# EAGLE schematic 8bit_computer (EAGLE 9.1.3)
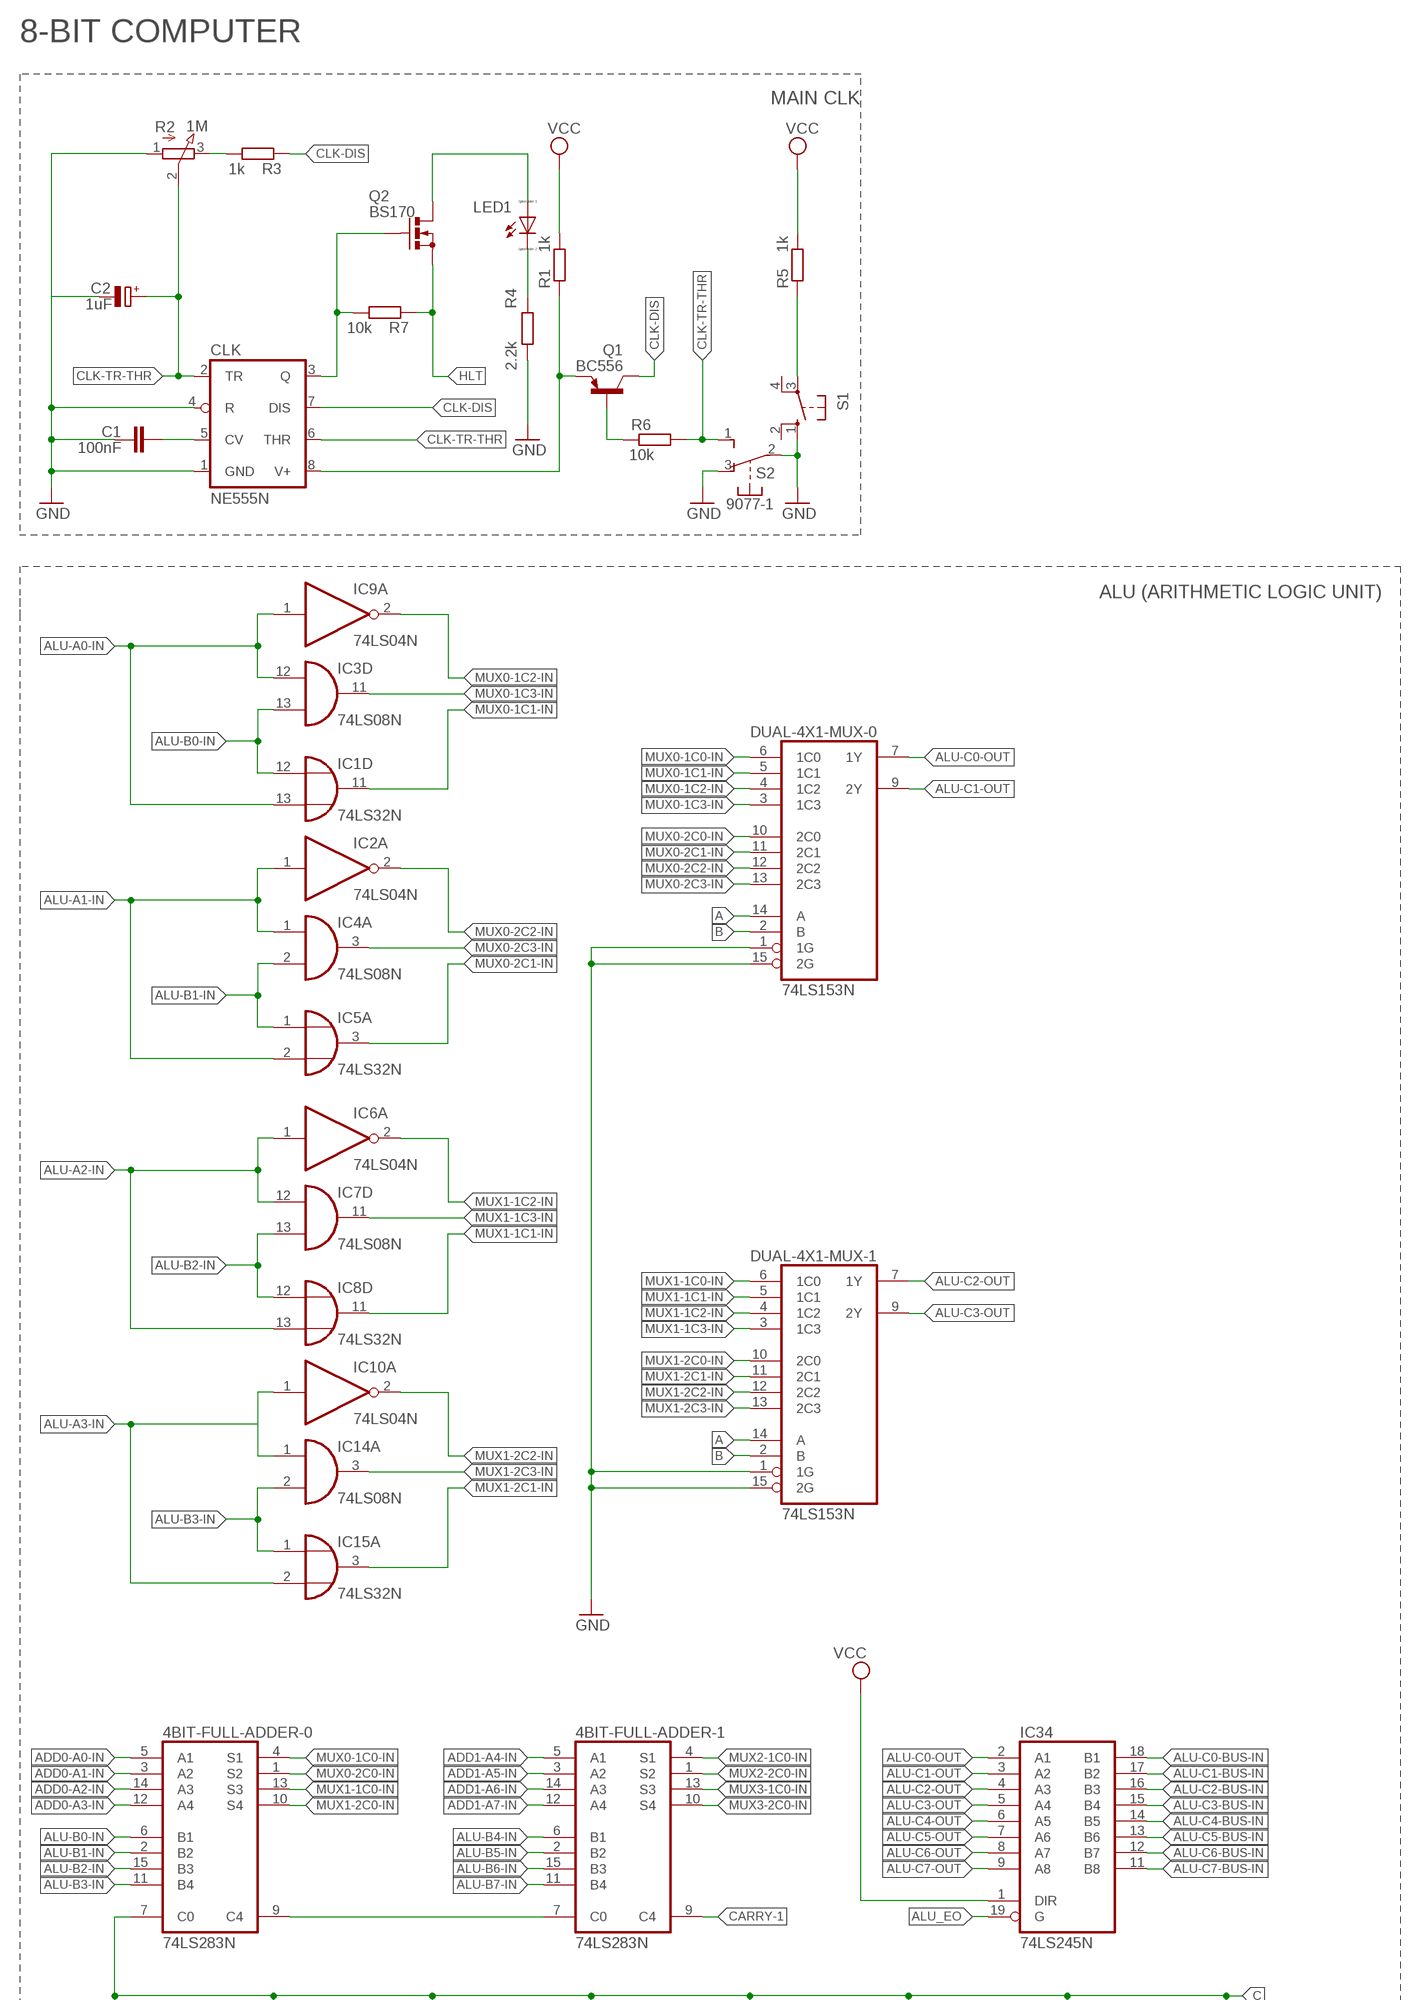
[diagram p0: schematic, sheet 1, part 1 of 3]
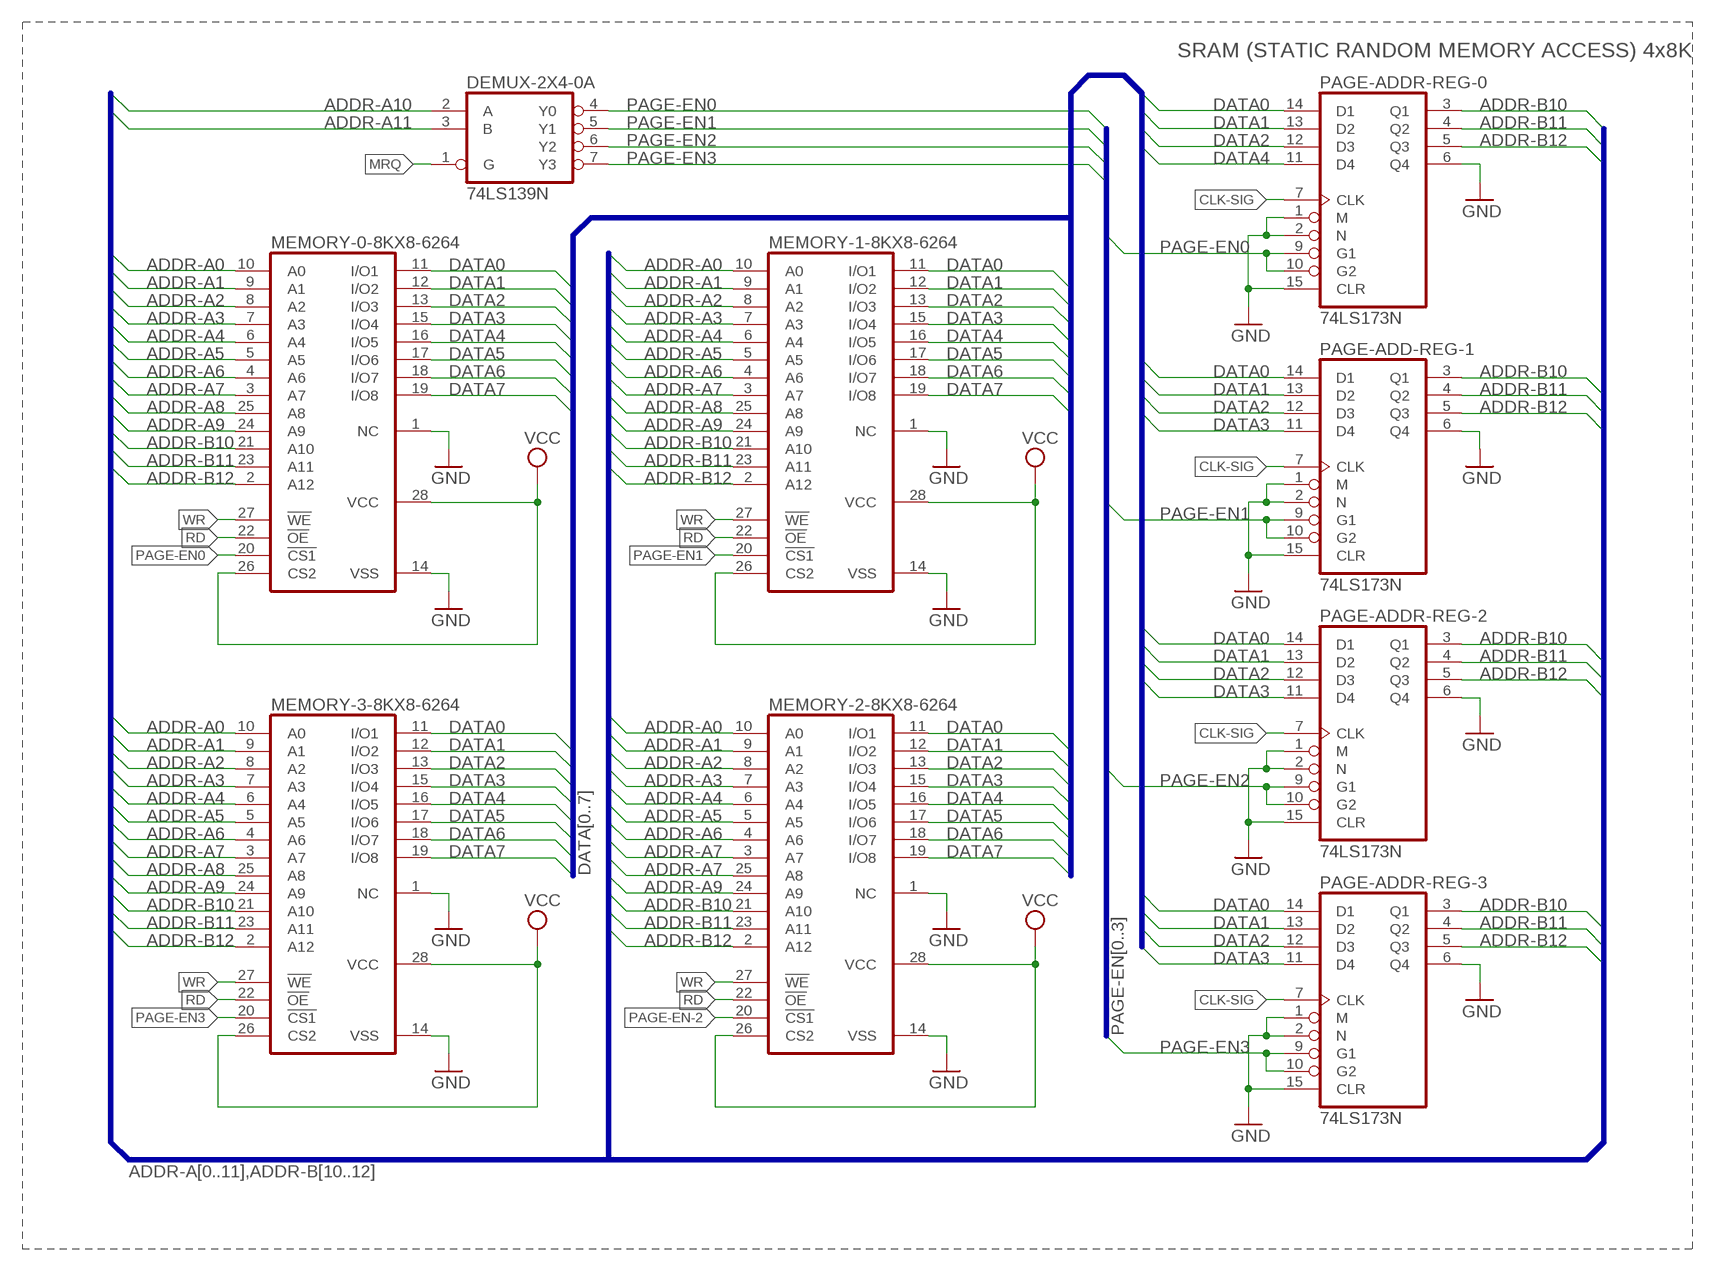
[diagram p1: schematic, sheet 1, part 2 of 3]
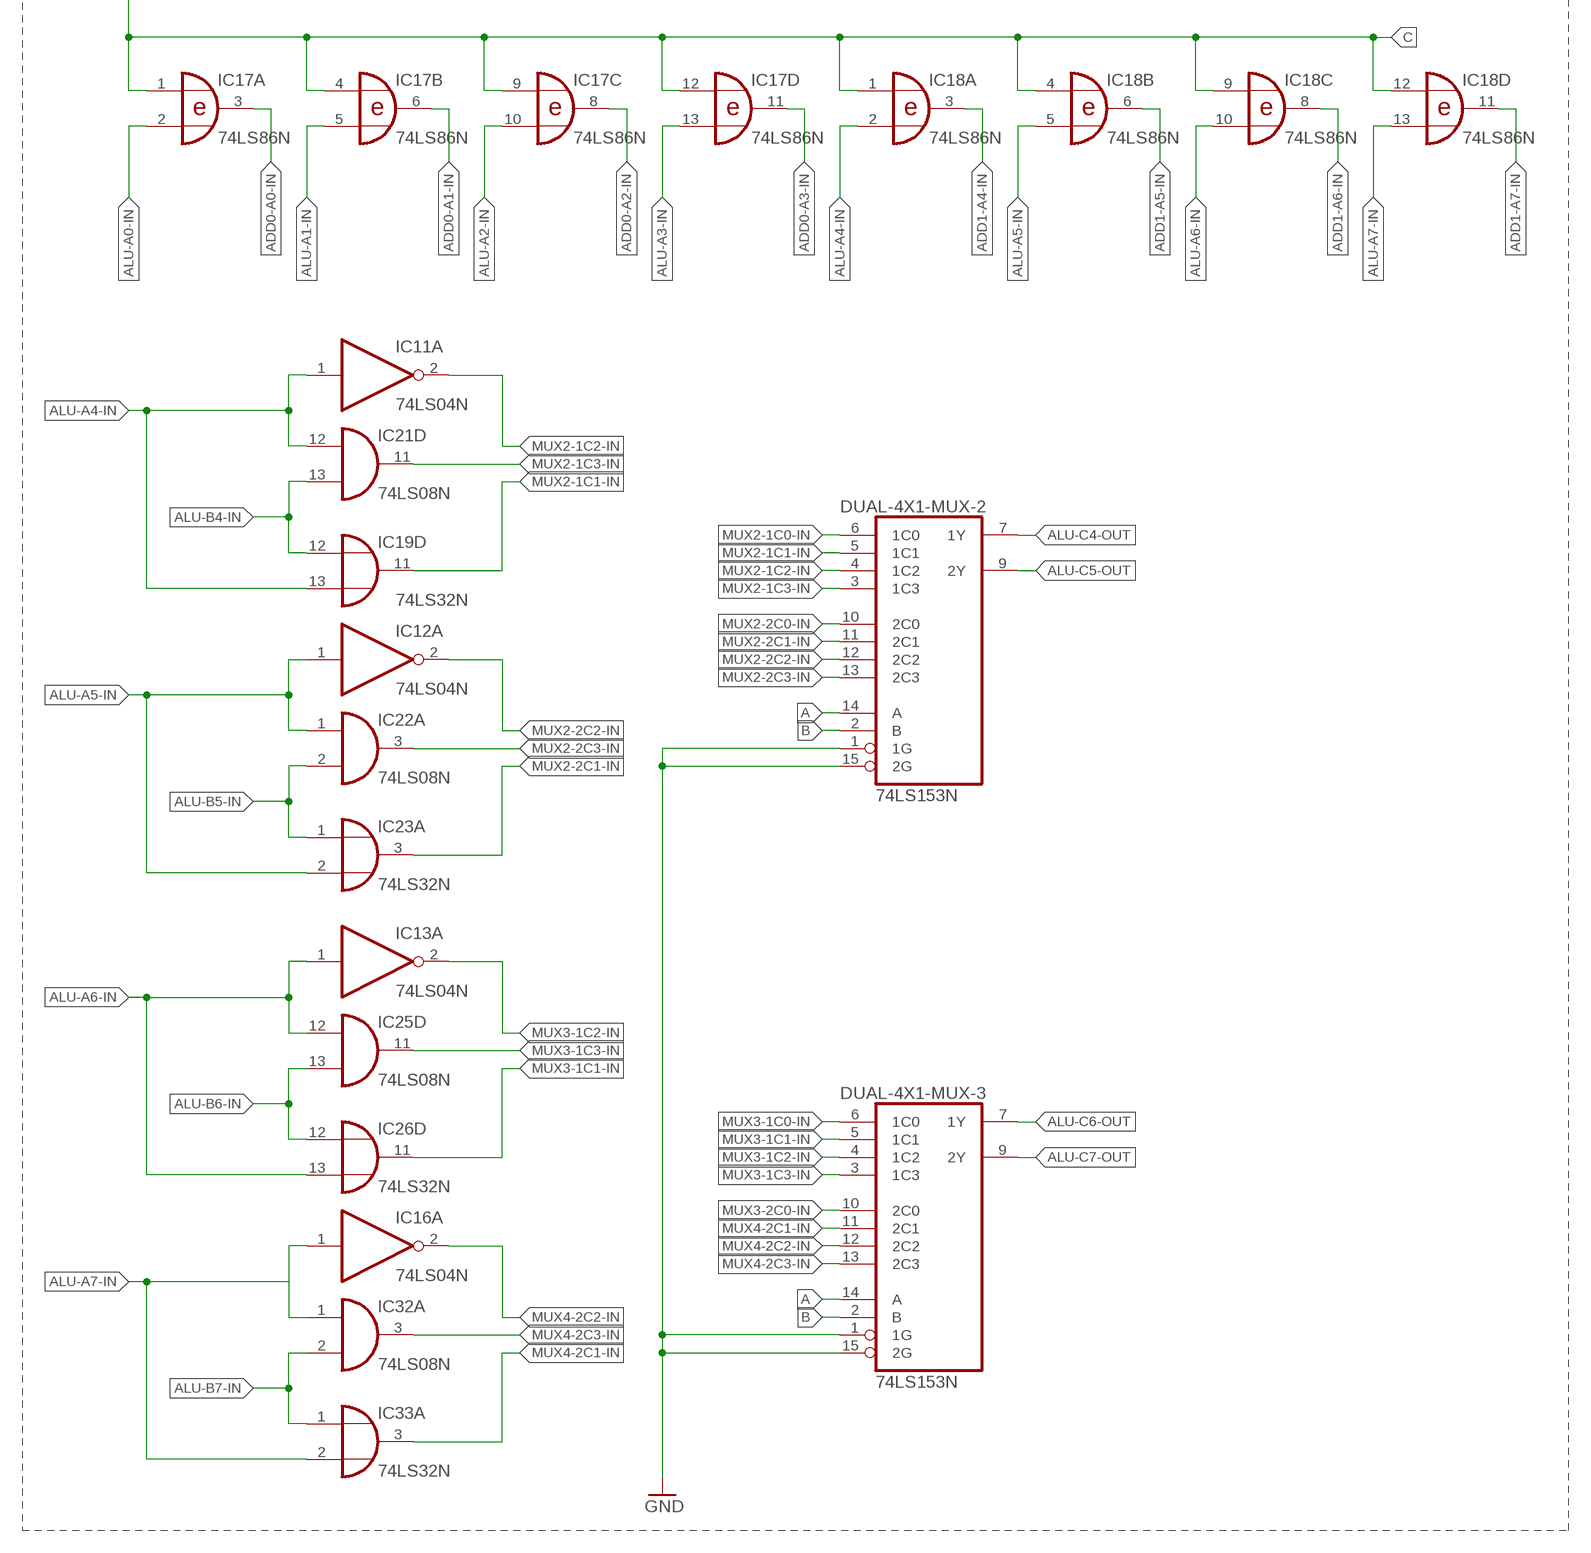
[diagram p2: schematic, sheet 1, part 3 of 3]

## Parts
4BIT-FULL-ADDER-0  74LS283N  [DIL16]
4BIT-FULL-ADDER-1  74LS283N  [DIL16]
C1  100nF  C-EU025-050X050  [C025-050X050]
C2  1uF  CPOL-EUE2-5  [E2-5]
CLK  NE555N  [DIL08]
DEMUX-2X4-0  74LS139N  [DIL16]
DUAL-4X1-MUX-0  74LS153N  [DIL16]
DUAL-4X1-MUX-1  74LS153N  [DIL16]
DUAL-4X1-MUX-2  74LS153N  [DIL16]
DUAL-4X1-MUX-3  74LS153N  [DIL16]
IC1  74LS32N  [DIL14]
IC2  74LS04N  [DIL14]
IC3  74LS08N  [DIL14]
IC4  74LS08N  [DIL14]
IC5  74LS32N  [DIL14]
IC6  74LS04N  [DIL14]
IC7  74LS08N  [DIL14]
IC8  74LS32N  [DIL14]
IC9  74LS04N  [DIL14]
IC10  74LS04N  [DIL14]
IC11  74LS04N  [DIL14]
IC12  74LS04N  [DIL14]
IC13  74LS04N  [DIL14]
IC14  74LS08N  [DIL14]
IC15  74LS32N  [DIL14]
IC16  74LS04N  [DIL14]
IC17  74LS86N  [DIL14]
IC18  74LS86N  [DIL14]
IC19  74LS32N  [DIL14]
IC21  74LS08N  [DIL14]
IC22  74LS08N  [DIL14]
IC23  74LS32N  [DIL14]
IC25  74LS08N  [DIL14]
IC26  74LS32N  [DIL14]
IC32  74LS08N  [DIL14]
IC33  74LS32N  [DIL14]
IC34  74LS245N  [DIL20]
LED1  LED_ELD260  [LED_LD260]
MEMORY-0-8KX8-6264  6264A  [DIL28-6]
MEMORY-1-8KX8-6264  6264A  [DIL28-6]
MEMORY-2-8KX8-6264  6264A  [DIL28-6]
MEMORY-3-8KX8-6264  6264A  [DIL28-6]
PAGE-ADD-REG-1  74LS173N  [DIL16]
PAGE-ADDR-REG-0  74LS173N  [DIL16]
PAGE-ADDR-REG-2  74LS173N  [DIL16]
PAGE-ADDR-REG-3  74LS173N  [DIL16]
Q1  BC556  [TO92-EBC]
Q2  BS170  [SOT54E]
R1  1k  R-EU_0204/5  [0204/5]
R2  1M  3RP/1610N  [3RP/1610N]
R3  1k  R-EU_0204/5  [0204/5]
R4  2.2k  R-EU_0204/5  [0204/5]
R5  1k  R-EU_0204/5  [0204/5]
R6  10k  R-EU_0204/5  [0204/5]
R7  10k  R-EU_0204/5  [0204/5]
S1  10-XX  [B3F-10XX]
S2  9077-1  [9077-1]

## Nets
A: DUAL-4X1-MUX-0.14(A) DUAL-4X1-MUX-1.14(A) DUAL-4X1-MUX-2.14(A) DUAL-4X1-MUX-3.14(A)
ADD0-A0-IN: 4BIT-FULL-ADDER-0.5(A1) IC17.3(A:O)
ADD0-A1-IN: 4BIT-FULL-ADDER-0.3(A2) IC17.6(B:O)
ADD0-A2-IN: 4BIT-FULL-ADDER-0.14(A3) IC17.8(C:O)
ADD0-A3-IN: 4BIT-FULL-ADDER-0.12(A4) IC17.11(D:O)
ADD1-A4-IN: 4BIT-FULL-ADDER-1.5(A1) IC18.3(A:O)
ADD1-A5-IN: 4BIT-FULL-ADDER-1.3(A2) IC18.6(B:O)
ADD1-A6-IN: 4BIT-FULL-ADDER-1.14(A3) IC18.8(C:O)
ADD1-A7-IN: 4BIT-FULL-ADDER-1.12(A4) IC18.11(D:O)
ADDR-A0: MEMORY-0-8KX8-6264.10(A0) MEMORY-1-8KX8-6264.10(A0) MEMORY-2-8KX8-6264.10(A0) MEMORY-3-8KX8-6264.10(A0)
ADDR-A1: MEMORY-0-8KX8-6264.9(A1) MEMORY-1-8KX8-6264.9(A1) MEMORY-2-8KX8-6264.9(A1) MEMORY-3-8KX8-6264.9(A1)
ADDR-A2: MEMORY-0-8KX8-6264.8(A2) MEMORY-1-8KX8-6264.8(A2) MEMORY-2-8KX8-6264.8(A2) MEMORY-3-8KX8-6264.8(A2)
ADDR-A3: MEMORY-0-8KX8-6264.7(A3) MEMORY-1-8KX8-6264.7(A3) MEMORY-2-8KX8-6264.7(A3) MEMORY-3-8KX8-6264.7(A3)
ADDR-A4: MEMORY-0-8KX8-6264.6(A4) MEMORY-1-8KX8-6264.6(A4) MEMORY-2-8KX8-6264.6(A4) MEMORY-3-8KX8-6264.6(A4)
ADDR-A5: MEMORY-0-8KX8-6264.5(A5) MEMORY-1-8KX8-6264.5(A5) MEMORY-2-8KX8-6264.5(A5) MEMORY-3-8KX8-6264.5(A5)
ADDR-A6: MEMORY-0-8KX8-6264.4(A6) MEMORY-1-8KX8-6264.4(A6) MEMORY-2-8KX8-6264.4(A6) MEMORY-3-8KX8-6264.4(A6)
ADDR-A7: MEMORY-0-8KX8-6264.3(A7) MEMORY-1-8KX8-6264.3(A7) MEMORY-2-8KX8-6264.3(A7) MEMORY-2-8KX8-6264.25(A8) MEMORY-3-8KX8-6264.3(A7)
ADDR-A8: MEMORY-0-8KX8-6264.25(A8) MEMORY-1-8KX8-6264.25(A8) MEMORY-3-8KX8-6264.25(A8)
ADDR-A9: MEMORY-0-8KX8-6264.24(A9) MEMORY-1-8KX8-6264.24(A9) MEMORY-2-8KX8-6264.24(A9) MEMORY-3-8KX8-6264.24(A9)
ADDR-A10: DEMUX-2X4-0.2(A:A)
ADDR-A11: DEMUX-2X4-0.3(A:B)
ADDR-B10: MEMORY-0-8KX8-6264.21(A10) MEMORY-1-8KX8-6264.21(A10) MEMORY-2-8KX8-6264.21(A10) MEMORY-3-8KX8-6264.21(A10) PAGE-ADD-REG-1.3(Q1) PAGE-ADDR-REG-0.3(Q1) PAGE-ADDR-REG-2.3(Q1) PAGE-ADDR-REG-3.3(Q1)
ADDR-B11: MEMORY-0-8KX8-6264.23(A11) MEMORY-1-8KX8-6264.23(A11) MEMORY-2-8KX8-6264.23(A11) MEMORY-3-8KX8-6264.23(A11) PAGE-ADD-REG-1.4(Q2) PAGE-ADDR-REG-0.4(Q2) PAGE-ADDR-REG-2.4(Q2) PAGE-ADDR-REG-3.4(Q2)
ADDR-B12: MEMORY-0-8KX8-6264.2(A12) MEMORY-1-8KX8-6264.2(A12) MEMORY-2-8KX8-6264.2(A12) MEMORY-3-8KX8-6264.2(A12) PAGE-ADD-REG-1.5(Q3) PAGE-ADDR-REG-0.5(Q3) PAGE-ADDR-REG-2.5(Q3) PAGE-ADDR-REG-3.5(Q3)
ALU-A0-IN: IC1.13(D:I1) IC3.12(D:I0) IC9.1(A:I) IC17.2(A:I1)
ALU-A1-IN: IC2.1(A:I) IC4.1(A:I0) IC5.2(A:I1) IC17.5(B:I1)
ALU-A2-IN: IC6.1(A:I) IC7.12(D:I0) IC8.13(D:I1) IC17.10(C:I1)
ALU-A3-IN: IC10.1(A:I) IC14.1(A:I0) IC15.2(A:I1) IC17.13(D:I1)
ALU-A4-IN: IC11.1(A:I) IC18.2(A:I1) IC19.13(D:I1) IC21.12(D:I0)
ALU-A5-IN: IC12.1(A:I) IC18.5(B:I1) IC22.1(A:I0) IC23.2(A:I1)
ALU-A6-IN: IC13.1(A:I) IC18.10(C:I1) IC25.12(D:I0) IC26.13(D:I1)
ALU-A7-IN: IC16.1(A:I) IC18.13(D:I1) IC32.1(A:I0) IC33.2(A:I1)
ALU-B0-IN: 4BIT-FULL-ADDER-0.6(B1) IC1.12(D:I0) IC3.13(D:I1)
ALU-B1-IN: 4BIT-FULL-ADDER-0.2(B2) IC4.2(A:I1) IC5.1(A:I0)
ALU-B2-IN: 4BIT-FULL-ADDER-0.15(B3) IC7.13(D:I1) IC8.12(D:I0)
ALU-B3-IN: 4BIT-FULL-ADDER-0.11(B4) IC14.2(A:I1) IC15.1(A:I0)
ALU-B4-IN: 4BIT-FULL-ADDER-1.6(B1) IC19.12(D:I0) IC21.13(D:I1)
ALU-B5-IN: 4BIT-FULL-ADDER-1.2(B2) IC22.2(A:I1) IC23.1(A:I0)
ALU-B6-IN: 4BIT-FULL-ADDER-1.15(B3) IC25.13(D:I1) IC26.12(D:I0)
ALU-B7-IN: 4BIT-FULL-ADDER-1.11(B4) IC32.2(A:I1) IC33.1(A:I0)
ALU-C0-BUS-IN: IC34.18(B1)
ALU-C0-OUT: DUAL-4X1-MUX-0.7(1Y) IC34.2(A1)
ALU-C1-BUS-IN: IC34.17(B2)
ALU-C1-OUT: DUAL-4X1-MUX-0.9(2Y) IC34.3(A2)
ALU-C2-BUS-IN: IC34.16(B3)
ALU-C2-OUT: DUAL-4X1-MUX-1.7(1Y) IC34.4(A3)
ALU-C3-BUS-IN: IC34.15(B4)
ALU-C3-OUT: DUAL-4X1-MUX-1.9(2Y) IC34.5(A4)
ALU-C4-BUS-IN: IC34.14(B5)
ALU-C4-OUT: DUAL-4X1-MUX-2.7(1Y) IC34.6(A5)
ALU-C5-BUS-IN: IC34.13(B6)
ALU-C5-OUT: DUAL-4X1-MUX-2.9(2Y) IC34.7(A6)
ALU-C6-BUS-IN: IC34.12(B7)
ALU-C6-OUT: DUAL-4X1-MUX-3.7(1Y) IC34.8(A7)
ALU-C7-BUS-IN: IC34.11(B8)
ALU-C7-OUT: DUAL-4X1-MUX-3.9(2Y) IC34.9(A8)
ALU_EO: IC34.19(G)
B: DUAL-4X1-MUX-0.2(B) DUAL-4X1-MUX-1.2(B) DUAL-4X1-MUX-2.2(B) DUAL-4X1-MUX-3.2(B)
C: 4BIT-FULL-ADDER-0.7(C0) IC17.1(A:I0) IC17.4(B:I0) IC17.9(C:I0) IC17.12(D:I0) IC18.1(A:I0) IC18.4(B:I0) IC18.9(C:I0) IC18.12(D:I0)
CARRY-1: 4BIT-FULL-ADDER-1.9(C4)
CLK-CV: C1.2 CLK.5(CV)
CLK-DIS: CLK.7(DIS) Q1.C R3.1
CLK-SIG: PAGE-ADD-REG-1.7(CLK) PAGE-ADDR-REG-0.7(CLK) PAGE-ADDR-REG-2.7(CLK) PAGE-ADDR-REG-3.7(CLK)
CLK-TR-THR: C2.+ CLK.2(TR) CLK.6(THR) Q1.B R2.2(S) R6.1 R6.2 S2.1(S)
DATA0: MEMORY-0-8KX8-6264.11(I/O1) MEMORY-1-8KX8-6264.11(I/O1) MEMORY-2-8KX8-6264.11(I/O1) MEMORY-3-8KX8-6264.11(I/O1) PAGE-ADD-REG-1.14(D1) PAGE-ADDR-REG-0.14(D1) PAGE-ADDR-REG-2.14(D1) PAGE-ADDR-REG-3.14(D1)
DATA1: MEMORY-0-8KX8-6264.12(I/O2) MEMORY-1-8KX8-6264.12(I/O2) MEMORY-2-8KX8-6264.12(I/O2) MEMORY-3-8KX8-6264.12(I/O2) PAGE-ADD-REG-1.13(D2) PAGE-ADDR-REG-0.13(D2) PAGE-ADDR-REG-2.13(D2) PAGE-ADDR-REG-3.13(D2)
DATA2: MEMORY-0-8KX8-6264.13(I/O3) MEMORY-1-8KX8-6264.13(I/O3) MEMORY-2-8KX8-6264.13(I/O3) MEMORY-3-8KX8-6264.13(I/O3) PAGE-ADD-REG-1.12(D3) PAGE-ADDR-REG-0.12(D3) PAGE-ADDR-REG-2.12(D3) PAGE-ADDR-REG-3.12(D3)
DATA3: MEMORY-0-8KX8-6264.15(I/O4) MEMORY-1-8KX8-6264.15(I/O4) MEMORY-2-8KX8-6264.15(I/O4) MEMORY-3-8KX8-6264.15(I/O4) PAGE-ADD-REG-1.11(D4) PAGE-ADDR-REG-2.11(D4) PAGE-ADDR-REG-3.11(D4)
DATA4: MEMORY-0-8KX8-6264.16(I/O5) MEMORY-1-8KX8-6264.16(I/O5) MEMORY-2-8KX8-6264.16(I/O5) MEMORY-3-8KX8-6264.16(I/O5) PAGE-ADDR-REG-0.11(D4)
DATA5: MEMORY-0-8KX8-6264.17(I/O6) MEMORY-1-8KX8-6264.17(I/O6) MEMORY-2-8KX8-6264.17(I/O6) MEMORY-3-8KX8-6264.17(I/O6)
DATA6: MEMORY-0-8KX8-6264.18(I/O7) MEMORY-1-8KX8-6264.18(I/O7) MEMORY-2-8KX8-6264.18(I/O7) MEMORY-3-8KX8-6264.18(I/O7)
DATA7: MEMORY-0-8KX8-6264.19(I/O8) MEMORY-1-8KX8-6264.19(I/O8) MEMORY-2-8KX8-6264.19(I/O8) MEMORY-3-8KX8-6264.19(I/O8)
GND: C1.1 C2.- CLK.1(GND) CLK.4(R) DUAL-4X1-MUX-0.1(1G) DUAL-4X1-MUX-0.15(2G) DUAL-4X1-MUX-1.1(1G) DUAL-4X1-MUX-1.15(2G) DUAL-4X1-MUX-2.1(1G) DUAL-4X1-MUX-2.15(2G) DUAL-4X1-MUX-3.1(1G) DUAL-4X1-MUX-3.15(2G) MEMORY-0-8KX8-6264.1(NC) MEMORY-0-8KX8-6264.14(VSS) MEMORY-1-8KX8-6264.1(NC) MEMORY-1-8KX8-6264.14(VSS) MEMORY-2-8KX8-6264.1(NC) MEMORY-2-8KX8-6264.14(VSS) MEMORY-3-8KX8-6264.1(NC) MEMORY-3-8KX8-6264.14(VSS) PAGE-ADD-REG-1.1(M) PAGE-ADD-REG-1.2(N) PAGE-ADD-REG-1.6(Q4) PAGE-ADD-REG-1.15(CLR) PAGE-ADDR-REG-0.1(M) PAGE-ADDR-REG-0.2(N) PAGE-ADDR-REG-0.6(Q4) PAGE-ADDR-REG-0.15(CLR) PAGE-ADDR-REG-2.1(M) PAGE-ADDR-REG-2.2(N) PAGE-ADDR-REG-2.6(Q4) PAGE-ADDR-REG-2.15(CLR) PAGE-ADDR-REG-3.1(M) PAGE-ADDR-REG-3.2(N) PAGE-ADDR-REG-3.6(Q4) PAGE-ADDR-REG-3.15(CLR) R2.1(A) R4.2 S1.1(S) S2.2(P) S2.3(O)
HLT: Q2.S R7.1
MRQ: DEMUX-2X4-0.1(A:G)
MUX0-1C0-IN: 4BIT-FULL-ADDER-0.4(S1) DUAL-4X1-MUX-0.6(1C0)
MUX0-1C1-IN: DUAL-4X1-MUX-0.5(1C1) IC1.11(D:O)
MUX0-1C2-IN: DUAL-4X1-MUX-0.4(1C2) IC9.2(A:O)
MUX0-1C3-IN: DUAL-4X1-MUX-0.3(1C3) IC3.11(D:O)
MUX0-2C0-IN: 4BIT-FULL-ADDER-0.1(S2) DUAL-4X1-MUX-0.10(2C0)
MUX0-2C1-IN: DUAL-4X1-MUX-0.11(2C1) IC5.3(A:O)
MUX0-2C2-IN: DUAL-4X1-MUX-0.12(2C2) IC2.2(A:O)
MUX0-2C3-IN: DUAL-4X1-MUX-0.13(2C3) IC4.3(A:O)
MUX1-1C0-IN: 4BIT-FULL-ADDER-0.13(S3) DUAL-4X1-MUX-1.6(1C0)
MUX1-1C1-IN: DUAL-4X1-MUX-1.5(1C1) IC8.11(D:O)
MUX1-1C2-IN: DUAL-4X1-MUX-1.4(1C2) IC6.2(A:O)
MUX1-1C3-IN: DUAL-4X1-MUX-1.3(1C3) IC7.11(D:O)
MUX1-2C0-IN: 4BIT-FULL-ADDER-0.10(S4) DUAL-4X1-MUX-1.10(2C0)
MUX1-2C1-IN: DUAL-4X1-MUX-1.11(2C1) IC15.3(A:O)
MUX1-2C2-IN: DUAL-4X1-MUX-1.12(2C2) IC10.2(A:O)
MUX1-2C3-IN: DUAL-4X1-MUX-1.13(2C3) IC14.3(A:O)
MUX2-1C0-IN: 4BIT-FULL-ADDER-1.4(S1) DUAL-4X1-MUX-2.6(1C0)
MUX2-1C1-IN: DUAL-4X1-MUX-2.5(1C1) IC19.11(D:O)
MUX2-1C2-IN: DUAL-4X1-MUX-2.4(1C2) IC11.2(A:O)
MUX2-1C3-IN: DUAL-4X1-MUX-2.3(1C3) IC21.11(D:O)
MUX2-2C0-IN: 4BIT-FULL-ADDER-1.1(S2) DUAL-4X1-MUX-2.10(2C0)
MUX2-2C1-IN: DUAL-4X1-MUX-2.11(2C1) IC23.3(A:O)
MUX2-2C2-IN: DUAL-4X1-MUX-2.12(2C2) IC12.2(A:O)
MUX2-2C3-IN: DUAL-4X1-MUX-2.13(2C3) IC22.3(A:O)
MUX3-1C0-IN: 4BIT-FULL-ADDER-1.13(S3) DUAL-4X1-MUX-3.6(1C0)
MUX3-1C1-IN: DUAL-4X1-MUX-3.5(1C1) IC26.11(D:O)
MUX3-1C2-IN: DUAL-4X1-MUX-3.4(1C2) IC13.2(A:O)
MUX3-1C3-IN: DUAL-4X1-MUX-3.3(1C3) IC25.11(D:O)
MUX3-2C0-IN: 4BIT-FULL-ADDER-1.10(S4) DUAL-4X1-MUX-3.10(2C0)
MUX4-2C1-IN: DUAL-4X1-MUX-3.11(2C1) IC33.3(A:O)
MUX4-2C2-IN: DUAL-4X1-MUX-3.12(2C2) IC16.2(A:O)
MUX4-2C3-IN: DUAL-4X1-MUX-3.13(2C3) IC32.3(A:O)
N$1: R5.1 S1.3(P)
N$2: R2.3(E) R3.2
N$3: CLK.8(V+) Q1.E R1.1
N$4: LED1.K(C) R4.1
N$5: 4BIT-FULL-ADDER-0.9(C4) 4BIT-FULL-ADDER-1.7(C0)
N$6: LED1.A Q2.D
PAGE-EN0: DEMUX-2X4-0.4(A:Y0) MEMORY-0-8KX8-6264.20(!CS1) PAGE-ADDR-REG-0.9(G1) PAGE-ADDR-REG-0.10(G2)
PAGE-EN1: DEMUX-2X4-0.5(A:Y1) MEMORY-1-8KX8-6264.20(!CS1) PAGE-ADD-REG-1.9(G1) PAGE-ADD-REG-1.10(G2)
PAGE-EN2: DEMUX-2X4-0.6(A:Y2) PAGE-ADDR-REG-2.9(G1) PAGE-ADDR-REG-2.10(G2)
PAGE-EN3: DEMUX-2X4-0.7(A:Y3) MEMORY-3-8KX8-6264.20(!CS1) PAGE-ADDR-REG-3.9(G1) PAGE-ADDR-REG-3.10(G2)
PAGE-EN-2: MEMORY-2-8KX8-6264.20(!CS1)
Q: CLK.3(Q) Q2.G R7.2
RD: MEMORY-0-8KX8-6264.22(!OE) MEMORY-1-8KX8-6264.22(!OE) MEMORY-2-8KX8-6264.22(!OE) MEMORY-3-8KX8-6264.22(!OE)
VCC: IC34.1(DIR) MEMORY-0-8KX8-6264.26(CS2) MEMORY-0-8KX8-6264.28(VCC) MEMORY-1-8KX8-6264.26(CS2) MEMORY-1-8KX8-6264.28(VCC) MEMORY-2-8KX8-6264.26(CS2) MEMORY-2-8KX8-6264.28(VCC) MEMORY-3-8KX8-6264.26(CS2) MEMORY-3-8KX8-6264.28(VCC) R1.2 R5.2
WR: MEMORY-0-8KX8-6264.27(!WE) MEMORY-1-8KX8-6264.27(!WE) MEMORY-2-8KX8-6264.27(!WE) MEMORY-3-8KX8-6264.27(!WE)
Unconnected: DEMUX-2X4-0.9(B:Y3) DEMUX-2X4-0.10(B:Y2) DEMUX-2X4-0.11(B:Y1) DEMUX-2X4-0.12(B:Y0) DEMUX-2X4-0.13(B:B) DEMUX-2X4-0.14(B:A) DEMUX-2X4-0.15(B:G) IC1.1(A:I0) IC1.2(A:I1) IC1.3(A:O) IC1.4(B:I0) IC1.5(B:I1) IC1.6(B:O) IC1.8(C:O) IC1.9(C:I0) IC1.10(C:I1) IC2.3(B:I) IC2.4(B:O) IC2.5(C:I) IC2.6(C:O) IC2.8(D:O) IC2.9(D:I) IC2.10(E:O) IC2.11(E:I) IC2.12(F:O) IC2.13(F:I) IC3.1(A:I0) IC3.2(A:I1) IC3.3(A:O) IC3.4(B:I0) IC3.5(B:I1) IC3.6(B:O) IC3.8(C:O) IC3.9(C:I0) IC3.10(C:I1) IC4.4(B:I0) IC4.5(B:I1) IC4.6(B:O) IC4.8(C:O) IC4.9(C:I0) IC4.10(C:I1) IC4.11(D:O) IC4.12(D:I0) IC4.13(D:I1) IC5.4(B:I0) IC5.5(B:I1) IC5.6(B:O) IC5.8(C:O) IC5.9(C:I0) IC5.10(C:I1) IC5.11(D:O) IC5.12(D:I0) IC5.13(D:I1) IC6.3(B:I) IC6.4(B:O) IC6.5(C:I) IC6.6(C:O) IC6.8(D:O) IC6.9(D:I) IC6.10(E:O) IC6.11(E:I) IC6.12(F:O) IC6.13(F:I) IC7.1(A:I0) IC7.2(A:I1) IC7.3(A:O) IC7.4(B:I0) IC7.5(B:I1) IC7.6(B:O) IC7.8(C:O) IC7.9(C:I0) IC7.10(C:I1) IC8.1(A:I0) IC8.2(A:I1) IC8.3(A:O) IC8.4(B:I0) IC8.5(B:I1) IC8.6(B:O) IC8.8(C:O) IC8.9(C:I0) IC8.10(C:I1) IC9.3(B:I) IC9.4(B:O) IC9.5(C:I) IC9.6(C:O) IC9.8(D:O) IC9.9(D:I) IC9.10(E:O) IC9.11(E:I) IC9.12(F:O) IC9.13(F:I) IC10.3(B:I) IC10.4(B:O) IC10.5(C:I) IC10.6(C:O) IC10.8(D:O) IC10.9(D:I) IC10.10(E:O) IC10.11(E:I) IC10.12(F:O) IC10.13(F:I) IC11.3(B:I) IC11.4(B:O) IC11.5(C:I) IC11.6(C:O) IC11.8(D:O) IC11.9(D:I) IC11.10(E:O) IC11.11(E:I) IC11.12(F:O) IC11.13(F:I) IC12.3(B:I) IC12.4(B:O) IC12.5(C:I) IC12.6(C:O) IC12.8(D:O) IC12.9(D:I) IC12.10(E:O) IC12.11(E:I) IC12.12(F:O) IC12.13(F:I) IC13.3(B:I) IC13.4(B:O) IC13.5(C:I) IC13.6(C:O) IC13.8(D:O) IC13.9(D:I) IC13.10(E:O) IC13.11(E:I) IC13.12(F:O) IC13.13(F:I) IC14.4(B:I0) IC14.5(B:I1) IC14.6(B:O) IC14.8(C:O) IC14.9(C:I0) IC14.10(C:I1) IC14.11(D:O) IC14.12(D:I0) IC14.13(D:I1) IC15.4(B:I0) IC15.5(B:I1) IC15.6(B:O) IC15.8(C:O) IC15.9(C:I0) IC15.10(C:I1) IC15.11(D:O) IC15.12(D:I0) IC15.13(D:I1) IC16.3(B:I) IC16.4(B:O) IC16.5(C:I) IC16.6(C:O) IC16.8(D:O) IC16.9(D:I) IC16.10(E:O) IC16.11(E:I) IC16.12(F:O) IC16.13(F:I) IC19.1(A:I0) IC19.2(A:I1) IC19.3(A:O) IC19.4(B:I0) IC19.5(B:I1) IC19.6(B:O) IC19.8(C:O) IC19.9(C:I0) IC19.10(C:I1) IC21.1(A:I0) IC21.2(A:I1) IC21.3(A:O) IC21.4(B:I0) IC21.5(B:I1) IC21.6(B:O) IC21.8(C:O) IC21.9(C:I0) IC21.10(C:I1) IC22.4(B:I0) IC22.5(B:I1) IC22.6(B:O) IC22.8(C:O) IC22.9(C:I0) IC22.10(C:I1) IC22.11(D:O) IC22.12(D:I0) IC22.13(D:I1) IC23.4(B:I0) IC23.5(B:I1) IC23.6(B:O) IC23.8(C:O) IC23.9(C:I0) IC23.10(C:I1) IC23.11(D:O) IC23.12(D:I0) IC23.13(D:I1) IC25.1(A:I0) IC25.2(A:I1) IC25.3(A:O) IC25.4(B:I0) IC25.5(B:I1) IC25.6(B:O) IC25.8(C:O) IC25.9(C:I0) IC25.10(C:I1) IC26.1(A:I0) IC26.2(A:I1) IC26.3(A:O) IC26.4(B:I0) IC26.5(B:I1) IC26.6(B:O) IC26.8(C:O) IC26.9(C:I0) IC26.10(C:I1) IC32.4(B:I0) IC32.5(B:I1) IC32.6(B:O) IC32.8(C:O) IC32.9(C:I0) IC32.10(C:I1) IC32.11(D:O) IC32.12(D:I0) IC32.13(D:I1) IC33.4(B:I0) IC33.5(B:I1) IC33.6(B:O) IC33.8(C:O) IC33.9(C:I0) IC33.10(C:I1) IC33.11(D:O) IC33.12(D:I0) IC33.13(D:I1) S1.2(S1) S1.4(P1)

## Buses
ADDR-A[0..11],ADDR-B[10..12]
PAGE-EN[0..3]
DATA[0..7]

## Notes on the sheet
- 8-BIT COMPUTER
- MAIN CLK
- ALU (ARITHMETIC LOGIC UNIT) | SRAM (STATIC RANDOM MEMORY ACCESS) 4x8K

## Power pins joined to a net without a drawn wire
GND: 4BIT-FULL-ADDER-0.8(GND) 4BIT-FULL-ADDER-1.8(GND) DEMUX-2X4-0.8(P:GND) DUAL-4X1-MUX-0.8(GND) DUAL-4X1-MUX-1.8(GND) DUAL-4X1-MUX-2.8(GND) DUAL-4X1-MUX-3.8(GND) IC1.7(P:GND) IC2.7(P:GND) IC3.7(P:GND) IC4.7(P:GND) IC5.7(P:GND) IC6.7(P:GND) IC7.7(P:GND) IC8.7(P:GND) IC9.7(P:GND) IC10.7(P:GND) IC11.7(P:GND) IC12.7(P:GND) IC13.7(P:GND) IC14.7(P:GND) IC15.7(P:GND) IC16.7(P:GND) IC17.7(P:GND) IC18.7(P:GND) IC19.7(P:GND) IC21.7(P:GND) IC22.7(P:GND) IC23.7(P:GND) IC25.7(P:GND) IC26.7(P:GND) IC32.7(P:GND) IC33.7(P:GND) IC34.10(GND) PAGE-ADD-REG-1.8(GND) PAGE-ADDR-REG-0.8(GND) PAGE-ADDR-REG-2.8(GND) PAGE-ADDR-REG-3.8(GND)
VCC: 4BIT-FULL-ADDER-0.16(VCC) 4BIT-FULL-ADDER-1.16(VCC) DEMUX-2X4-0.16(P:VCC) DUAL-4X1-MUX-0.16(VCC) DUAL-4X1-MUX-1.16(VCC) DUAL-4X1-MUX-2.16(VCC) DUAL-4X1-MUX-3.16(VCC) IC1.14(P:VCC) IC2.14(P:VCC) IC3.14(P:VCC) IC4.14(P:VCC) IC5.14(P:VCC) IC6.14(P:VCC) IC7.14(P:VCC) IC8.14(P:VCC) IC9.14(P:VCC) IC10.14(P:VCC) IC11.14(P:VCC) IC12.14(P:VCC) IC13.14(P:VCC) IC14.14(P:VCC) IC15.14(P:VCC) IC16.14(P:VCC) IC17.14(P:VCC) IC18.14(P:VCC) IC19.14(P:VCC) IC21.14(P:VCC) IC22.14(P:VCC) IC23.14(P:VCC) IC25.14(P:VCC) IC26.14(P:VCC) IC32.14(P:VCC) IC33.14(P:VCC) IC34.20(VCC) PAGE-ADD-REG-1.16(VCC) PAGE-ADDR-REG-0.16(VCC) PAGE-ADDR-REG-2.16(VCC) PAGE-ADDR-REG-3.16(VCC)

## Library data of the parts
4BIT-FULL-ADDER-0 4BIT-FULL-ADDER-1 = 74xx-eu:74*283: 4-bit binary FULL ADDER, fast carry
C1 = resistor:C-EU: CAPACITOR, European symbol
C2 = rcl:CPOL-EU: POLARIZED CAPACITOR, European symbol; SPICEPREFIX: C
CLK = linear:*555: TIMER
DEMUX-2X4-0 = 74xx-eu:74*139: Dual 2-line to 4-line DECODER/DEMULTIPLEXER
DUAL-4X1-MUX-0 DUAL-4X1-MUX-1-DUAL-4X1-MUX-3 = 74xx-eu:74*153: Dual 4-line to 1-line data SELECTOR/MULTIPLEXER
IC1 IC5 IC8 IC15 IC19 IC23 IC26 IC33 = 74xx-eu:74*32: Quad 2-input OR gate
IC2 IC6 IC9-IC13 IC16 = 74xx-eu:74*04: Hex INVERTER
IC3 IC4 IC7 IC14 IC21 IC22 IC25 IC32 = 74xx-eu:74*08: Quad 2-input AND gate
IC17 IC18 = 74xx-eu:74*86: Quad 2-input EXCLUSIVE-OR (XOR) gate
IC34 = 74xx-eu:74*245: Octal BUS TRANSCEIVER, 3-state
LED1 = eagle-ltspice:LED_E: LED Source: http://www.osram.convergy.de Source: www.luxeon.com Source: www.kingbright.com; SPICEMODEL: NONE; SPICEPREFIX: D; SPICETYPE: diode
MEMORY-0-8KX8-6264 MEMORY-1-8KX8-6264 MEMORY-2-8KX8-6264 MEMORY-3-8KX8-6264 = memory-hitachi:6264A: MEMORY; OC_FARNELL: 283605; OC_NEWARK: unknown
PAGE-ADD-REG-1 PAGE-ADDR-REG-0 PAGE-ADDR-REG-2 PAGE-ADDR-REG-3 = 74xx-eu:74*173: 4-bit D type REGISTER, 3-state
Q1 = transistor-pnp:BC556*: PNP Transistror
Q2 = transistor-small-signal:BS170: N-CHANNEL MOS FET
R1 R3-R7 = resistor:R-EU_: RESISTOR, European symbol
R2 = pot:3RP/1610N: 16mm Potentiometer one level Source: http://www.alphapotentiometers.net/html/16mm_pot_2.html
S1 = switch-omron:10-XX: OMRON SWITCH; MPN: B3F-1000; OC_FARNELL: 176432; OC_NEWARK: 36M3542
S2 = switch-misc:9077-1: MARQUARDT SWITCH 9077.0100 Distributor: Buerklin <https://www.buerklin.com/default.asp?event=ShowArtikel%2812G2820%29&l=d&jump=ArtNr_12G2820>